# Altium schematic sheet VCO.SchDoc
size A4; SheetNumber: 3; SheetTotal: 5
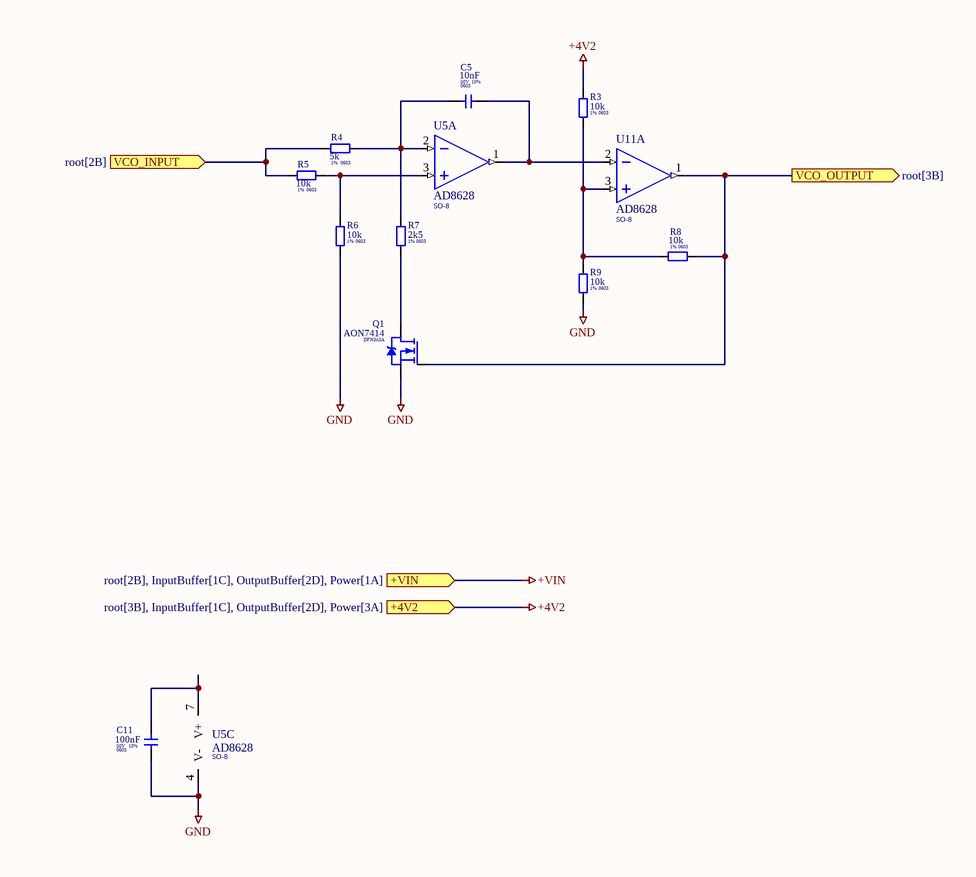
[diagram p0: VCO.SchDoc]

## Parts
C5  value 10nF  Voltage: 50V  Tolerant: 10%  Package: 0603  [CAPC1608X06M]  (hidden comment: 10nF/50V)
C11  value 100nF  Voltage: 50V  Tolerant: 10%  Package: 0603  [CAPC1608X06M]  (hidden comment: 100nF/50V)
Q1  Package: DFN3x3A  [SON65P300X90-3L]  (hidden comment: AON7414)
R3  value 10k  Package: 0603  Tolerance: 1%  [RESC1608X06L]  (hidden comment: 10k 1%)
R4  value 5k  Package: 0603  Tolerance: 1%  [RESC1608X06L]  (hidden comment: 5k 1%)
R5  value 10k  Package: 0603  Tolerance: 1%  [RESC1608X06L]  (hidden comment: 10k 1%)
R6  value 10k  Package: 0603  Tolerance: 1%  [RESC1608X06L]  (hidden comment: 10k 1%)
R7  value 2k5  Package: 0603  Tolerance: 1%  [RESC1608X06L]  (hidden comment: 2k5 1%)
R8  value 10k  Package: 0603  Tolerance: 1%  [RESC1608X06L]  (hidden comment: 10k 1%)
R9  value 10k  Package: 0603  Tolerance: 1%  [RESC1608X06L]  (hidden comment: 10k 1%)
U5  Package: SO-8  [SOIC127P600X170-8N]  (hidden comment: AD8628)  (parts A,C of 3)
U11  Package: SO-8  [SOIC127P600X170-8N]  (hidden comment: AD8628)  (part A of 3)

## Ports
+4V2 (in, see root[3B], InputBuffer[1C], OutputBuffer[2D], Power[3A]), +VIN (in, see root[2B], InputBuffer[1C], OutputBuffer[2D], Power[1A]), VCO_INPUT (in, see root[2B]), VCO_OUTPUT (out, see root[3B])

## Nets
+4V2: R3.2 ; port +4V2
+VIN: port +VIN
GND: C11.1 Q1.1(S) R6.1 R9.1 U5.4(V-)
VCO_INPUT: R4.1 R5.1 ; port VCO_INPUT
VCO_OUTPUT: Q1.2(G) R8.1 U11.1(OUT) ; port VCO_OUTPUT
NetC5_1: C5.1 R4.2 R7.2 U5.2(IN-)
NetC5_2: C5.2 U5.1(OUT) U11.2(IN-)
NetC11_2: C11.2 U5.7(V+)
NetQ1_3: Q1.3(D) R7.1
NetR3_1: R3.1 R8.2 R9.2 U11.3(IN+)
NetR5_2: R5.2 R6.2 U5.3(IN+)

## Library data of the parts
C5 C11 = C
Q1 = AON7414: 30V, 15A N-Channel MOSFET; manufacture: https://www.tme.eu/pl/details/aon7414/tranzystory-z-kanalem-n-smd/alpha-omega-semiconductor/; helpurl: https://www.tme.eu/Document/bbe6d91c24f2d151d9c9588885823e7b/AON7414-DTE.pdf; value: AON7414
R3-R9 = R
U5 U11 = AD8628ARZ: Zero-Drift, Single-Supply, Rail-to-Rail Input/Output Operational Amplifier; Manufacture: Analog; helpurl: https://www.analog.com/media/en/technical-documentation/data-sheets/ad8628-8629-8630.pdf; value: AD8628